# Altium schematic sheet CPU_ROM.SchDoc
size A4
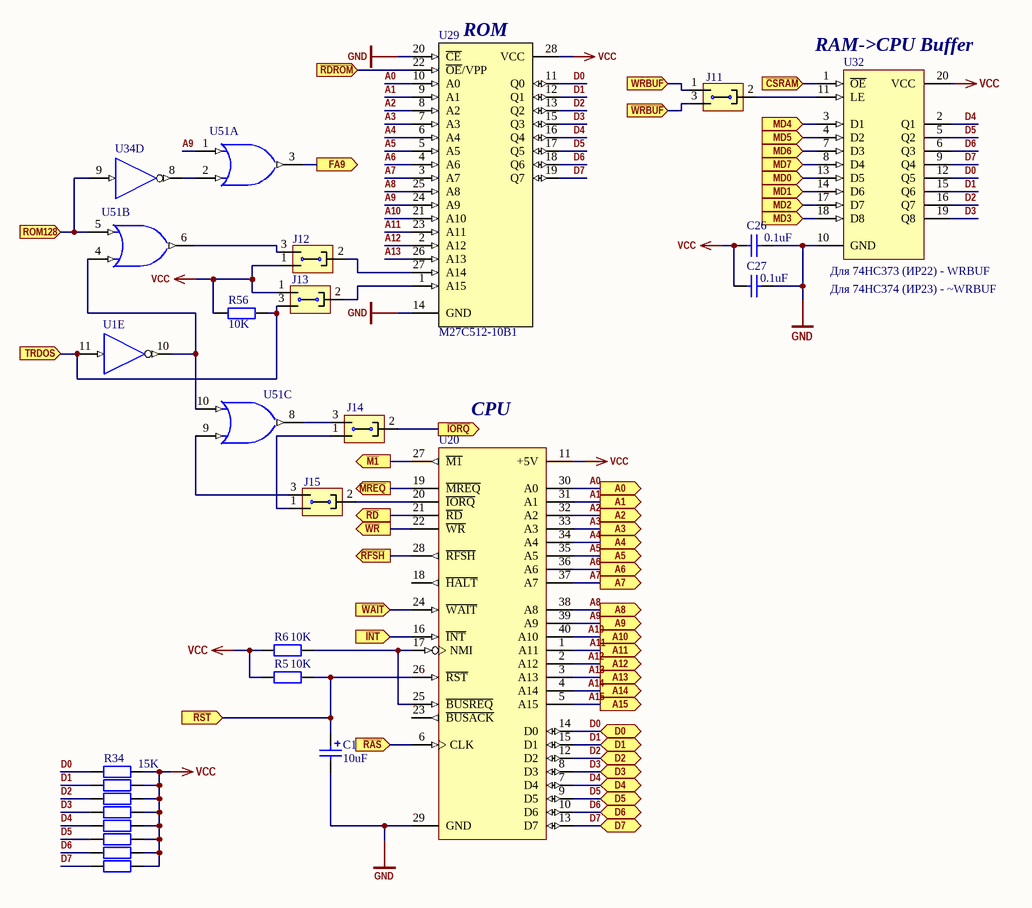
[diagram p0: CPU_ROM.SchDoc]

## Parts
C1  value 10uF  [JRB-5D]  (hidden comment: Cap Pol1)
C26  value 0.1uF  [RAD-0.3]  (hidden comment: Cap)
C27  value 0.1uF  [RAD-0.3]  (hidden comment: Cap)
J11  Jump3  [MHDR1X3]  (value not drawn)
J12  Jump3  [MHDR1X3]  (value not drawn)
J13  Jump3  [MHDR1X3]  (value not drawn)
J14  Jump3  [MHDR1X3]  (value not drawn)
J15  Jump3  [MHDR1X3]  (value not drawn)
R5  value 10K  [AXIAL-0.4]
R6  value 10K  [AXIAL-0.4]
R34  value 15K  [AXIAL-0.4]
R35  (no value)  [AXIAL-0.4]
R37  (no value)  [AXIAL-0.4]
R39  (no value)  [AXIAL-0.4]
R41  (no value)  [AXIAL-0.4]
R43  (no value)  [AXIAL-0.4]
R47  (no value)  [AXIAL-0.4]
R48  (no value)  [AXIAL-0.4]
R56  value 10K  [AXIAL-0.4]
U1  (no value)  [N014]  (part E of 6)
U20  Z84C0004PEC  [PDIP40]  (value not drawn)
U29  M27C512-10B1  [PDIP28]
U32  (no value)  [N020]
U34  (no value)  [N014]  (part D of 6)
U51  SN74HC32N  [N014]  (value not drawn)  (parts A,B,C of 4)

## Ports
A0 (out), A1 (out), A2 (out), A3 (out), A4 (out), A5 (out), A6 (out), A7 (out), A8 (out), A9 (out), A10 (out), A11 (out), A12 (out), A13 (out), A14 (out), A15 (out), D0 (bidir), D1 (bidir), D2 (bidir), D3 (bidir), D4 (bidir), D5 (bidir), D6 (bidir), D7 (bidir), FA9 (out), MD0 (in), MD1 (in), MD2 (in), MD3 (in), MD4 (in), MD5 (in), MD6 (in), MD7 (in), ROM128 (in), TRDOS (in), WRBUF (in), ~{CSRAM} (in), ~{INT} (in), ~{IORQ} (out), ~{M1} (out), ~{MREQ} (out), ~{RAS} (in), ~{RDROM} (in), ~{RD} (out), ~{RFSH} (out), ~{RST} (in), ~{WAIT} (in), ~{WRBUF} (in), ~{WR} (out)

## Nets
GND: C1.2 C26.2 C27.2 U1.7(GND) U20.29(GND) U29.14(GND) U29.20(~{CE}) U32.10(GND) U34.7(GND) U51.7(GND)
VCC: C26.1 C27.1 J12.1 J13.1 R5.1 R6.2 R34.2 R35.2 R37.2 R39.2 R41.2 R43.2 R47.2 R48.2 R56.1 U1.14(VCC) U20.11(+5V) U29.28(VCC) U32.20(VCC) U34.14(VCC) U51.14(VCC)
A0: U20.30(A0) U29.10(A0) ; port A0
A1: U20.31(A1) U29.9(A1) ; port A1
A2: U20.32(A2) U29.8(A2) ; port A2
A3: U20.33(A3) U29.7(A3) ; port A3
A4: U20.34(A4) U29.6(A4) ; port A4
A5: U20.35(A5) U29.5(A5) ; port A5
A6: U20.36(A6) U29.4(A6) ; port A6
A7: U20.37(A7) U29.3(A7) ; port A7
A8: U20.38(A8) U29.25(A8) ; port A8
A9: U20.39(A9) U29.24(A9) U51.1(A) ; port A9
A10: U20.40(A10) U29.21(A10) ; port A10
A11: U20.1(A11) U29.23(A11) ; port A11
A12: U20.2(A12) U29.2(A12) ; port A12
A13: U20.3(A13) U29.26(A13) ; port A13
A14: U20.4(A14) ; port A14
A15: U20.5(A15) ; port A15
~{CSRAM}: U32.1(~{OE}) ; port ~{CSRAM}
D0: R34.1 U20.14(D0) U29.11(Q0) U32.12(Q5) ; port D0
D1: R35.1 U20.15(D1) U29.12(Q1) U32.15(Q6) ; port D1
D2: R37.1 U20.12(D2) U29.13(Q2) U32.16(Q7) ; port D2
D3: R39.1 U20.8(D3) U29.15(Q3) U32.19(Q8) ; port D3
D4: R41.1 U20.7(D4) U29.16(Q4) U32.2(Q1) ; port D4
D5: R43.1 U20.9(D5) U29.17(Q5) U32.5(Q2) ; port D5
D6: R47.1 U20.10(D6) U29.18(Q6) U32.6(Q3) ; port D6
D7: R48.1 U20.13(D7) U29.19(Q7) U32.9(Q4) ; port D7
FA9: U51.3(Y) ; port FA9
~{INT}: U20.16(~{INT}) ; port ~{INT}
~{IORQ}: J14.2 ; port ~{IORQ}
~{M1}: U20.27(~{M1}) ; port ~{M1}
~{MREQ}: U20.19(~{MREQ}) ; port ~{MREQ}
MD0: U32.13(D5) ; port MD0
MD1: U32.14(D6) ; port MD1
MD2: U32.17(D7) ; port MD2
MD3: U32.18(D8) ; port MD3
MD4: U32.3(D1) ; port MD4
MD5: U32.4(D2) ; port MD5
MD6: U32.7(D3) ; port MD6
MD7: U32.8(D4) ; port MD7
~{RAS}: U20.6(CLK) ; port ~{RAS}
~{RD}: U20.21(~{RD}) ; port ~{RD}
~{RDROM}: U29.22(~{OE}/VPP) ; port ~{RDROM}
~{RFSH}: U20.28(~{RFSH}) ; port ~{RFSH}
~{RST}: C1.1 R5.2 U20.26(~{RST}) ; port ~{RST}
ROM128: U34.9(A) U51.5(B) ; port ROM128
TRDOS: J13.3 R56.2 U1.11(A) ; port TRDOS
~{WAIT}: U20.24(~{WAIT}) ; port ~{WAIT}
~{WR}: U20.22(~{WR}) ; port ~{WR}
~{WRBUF}: J11.3 ; port ~{WRBUF}
WRBUF: J11.1 ; port WRBUF
NetJ11_2: J11.2 U32.11(LE)
NetJ12_2: J12.2 U29.27(A14)
NetJ12_3: J12.3 U51.6(Y)
NetJ13_2: J13.2 U29.1(A15)
NetJ14_1: J14.1 J15.1
NetJ14_3: J14.3 U51.8(Y)
NetJ15_2: J15.2 U20.20(~{IORQ})
NetJ15_3: J15.3 U51.9(A)
NetR6_1: R6.1 U20.17(NMI) U20.25(~{BUSREQ})
NetU1_10: U1.10(Y) U51.4(A) U51.10(B)
NetU34_8: U34.8(Y) U51.2(B)

Not connected (* = marked no-connect by the designer): U20 18(~{HALT}) 23(~{BUSACK})

## Notes on the sheet
- (near U29) ROM
- (near U32) RAM->CPU Buffer
- (near U32) Для 74HC373 (ИР22) - WRBUF
- (near U32) Для 74HC374 (ИР23) - ~WRBUF
- (near U20) CPU

## Library data of the parts
C1 = Cap Pol1: Polarized Capacitor (Radial); Published: 8-Jun-2000; LatestRevisionDate: 17-Jul-2002; LatestRevisionNote: Re-released for DXP Platform.; PackageReference: RB7.6-15; Publisher: Altium Limited; PackageDescription: Polarized Capacitor (Radial); 2 Leads
C26 C27 = Cap: Capacitor; Published: 8-Jun-2000; LatestRevisionDate: 17-Jul-2002; LatestRevisionNote: Re-released for DXP Platform.; PackageReference: RAD-0.3; Publisher: Altium Limited; PackageDescription: Radial Cap, Thru-Hole; 2 Leads; 0.3 in Pin Spacing
R5 R6 R34 R56 = Res2: Resistor; Published: 8-Jun-2000; LatestRevisionDate: 17-Jul-2002; LatestRevisionNote: Re-released for DXP Platform.; PackageReference: AXIAL-0.4; Publisher: Altium Limited; PackageDescription: Axial Device, Thru-Hole; 2 Leads; 0.4 in Pin Spacing
R35 R37 R39 R41 R43 R47 R48 = Res2: Resistor; Value: 15K; Published: 8-Jun-2000; LatestRevisionDate: 17-Jul-2002; LatestRevisionNote: Re-released for DXP Platform.; PackageReference: AXIAL-0.4; Publisher: Altium Limited; PackageDescription: Axial Device, Thru-Hole; 2 Leads; 0.4 in Pin Spacing
U1 U34 = SN74HC04N: Hex Inverter; Published: 8-Jun-2000; LatestRevisionDate: 04-Mar-2005; LatestRevisionNote: Stylized 3D Model Added.; DatasheetVersion: May-1997; PackageVersion: Oct-1995; PackageReference: N014; Publisher: Altium Limited; PackageDescription: DIP; 14 Leads; Row Spacing 7.62 mm; Pitch 2.54 mm; ComponentLink1Description: Manufacturer Link; ComponentLink1URL: http://www.ti.com/; ComponentLink2Description: Datasheet; ComponentLink2URL: http://www-s.ti.com/sc/ds/sn74hc04.pdf
U20 = Z84C0004PEC: CMOS 8-Bit Microprocessor; Published: 15-Apr-2002; LatestRevisionDate: 04-Mar-2005; LatestRevisionNote: Stylized 3D Model Added.; DatasheetVersion: Jan-1989; PackageVersion: Jun-1999; PackageReference: PDIP40; Publisher: Altium Limited; PackageDescription: DIP; 40 Leads; Row Spacing 15.24 mm; Pitch 2.54 mm; ComponentLink1Description: Manufacturer Link; ComponentLink1URL: http://www.zilog.com/
U29 = M27C512-10B1: 512 Kbit (64Kb x 8) UV EPROM and OTP EPROM; Published: 24-Aug-2001; LatestRevisionDate: 06-Jun-2005; LatestRevisionNote: Stylized 3D Model Added.; DatasheetVersion: Nov-1998; PackageVersion: Jan-2003; PackageReference: PDIP28; Publisher: Altium Limited; PackageDescription: DIP; 28 Leads; Row Spacing 15.24 mm; Pitch 2.54 mm; ComponentLink1Description: Manufacturer Link; ComponentLink1URL: http://www.st.com/; ComponentLink2Description: Datasheet; ComponentLink2URL: http://www.st.com/stonline/products/literature/ds/2387/m27c512.pdf
U32 = SN74HC373N: Octal Transparent D-Type Latches with 3-State Outputs; Published: 8-Jun-2000; LatestRevisionDate: 04-Mar-2005; LatestRevisionNote: Stylized 3D Model Added.; DatasheetVersion: May-1997; PackageVersion: Oct-1995; PackageReference: N020; Publisher: Altium Limited; PackageDescription: DIP; 20 Leads; Row Spacing 7.62 mm; Pitch 2.54 mm; ComponentLink1Description: Manufacturer Link; ComponentLink1URL: http://www.ti.com/; ComponentLink2Description: Datasheet; ComponentLink2URL: http://www-s.ti.com/sc/ds/sn54hc373.pdf
U51 = SN74HC32N: Quadruple 2-Input Positive-OR Gate; Published: 8-Jun-2000; LatestRevisionDate: 04-Mar-2005; LatestRevisionNote: Stylized 3D Model Added.; DatasheetVersion: May-1997; PackageVersion: Oct-1995; PackageReference: N014; Publisher: Altium Limited; PackageDescription: DIP; 14 Leads; Row Spacing 7.62 mm; Pitch 2.54 mm; ComponentLink1Description: Manufacturer Link; ComponentLink1URL: http://www.ti.com/; ComponentLink2Description: Datasheet; ComponentLink2URL: http://www-s.ti.com/sc/ds/sn74hc32.pdf